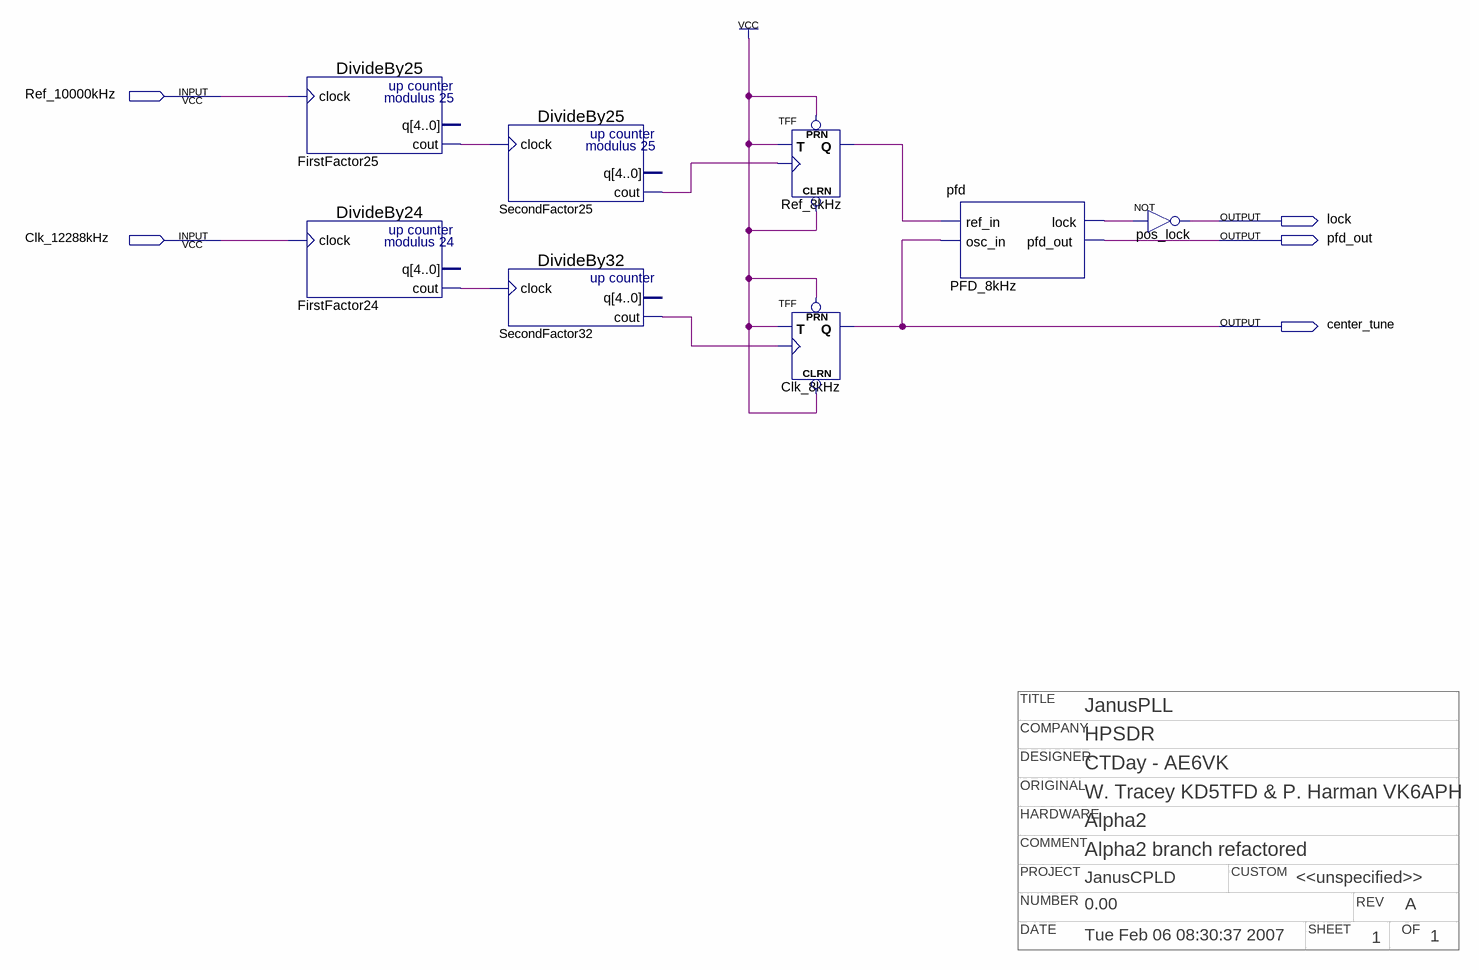
[diagram p0: schematic sheet]
// Quartus schematic JanusPLL.bdf as structural Verilog: 8 symbols, 5 pins
// Title block: TITLE: JanusPLL; COMPANY: HPSDR; DESIGNER: CTDay - AE6VK; NUMBER: 0.00; REV: A; DATE: Tue Feb 06 08:30:37 2007; SHEET: 1; OF: 1; ORIGINAL: W. Tracey KD5TFD & P. Harman VK6APH; HARDWARE: Alpha2; COMMENT: Alpha2 branch refactored; PROJECT: JanusCPLD; CUSTOM: <<unspecified>>
module JanusPLL (
  input  Ref_10000kHz,
  input  Clk_12288kHz,
  output lock,
  output pfd_out,
  output center_tune
);

  wire FirstFactor24_cout, FirstFactor25_cout, PFD_8kHz_lock, Ref_8kHz_q, SecondFactor25_cout,
       SecondFactor32_cout;

  DivideBy25 FirstFactor25 (.clock(Ref_10000kHz), .cout(FirstFactor25_cout));  // open: q
  DivideBy24 FirstFactor24 (.clock(Clk_12288kHz), .cout(FirstFactor24_cout));  // open: q
  DivideBy25 SecondFactor25 (.clock(FirstFactor25_cout), .cout(SecondFactor25_cout));  // open: q
  DivideBy32 SecondFactor32 (.clock(FirstFactor24_cout), .cout(SecondFactor32_cout));  // open: q
  TFF Ref_8kHz (.PRN(1'b1), .CLRN(1'b1), .T(1'b1), .CLK(SecondFactor25_cout), .Q(Ref_8kHz_q));
  TFF Clk_8kHz (.PRN(1'b1), .CLRN(1'b1), .T(1'b1), .CLK(SecondFactor32_cout), .Q(center_tune));
  pfd PFD_8kHz (.ref_in(Ref_8kHz_q), .osc_in(center_tune), .lock(PFD_8kHz_lock), .pfd_out(pfd_out));
  not pos_lock (lock, PFD_8kHz_lock);
endmodule
